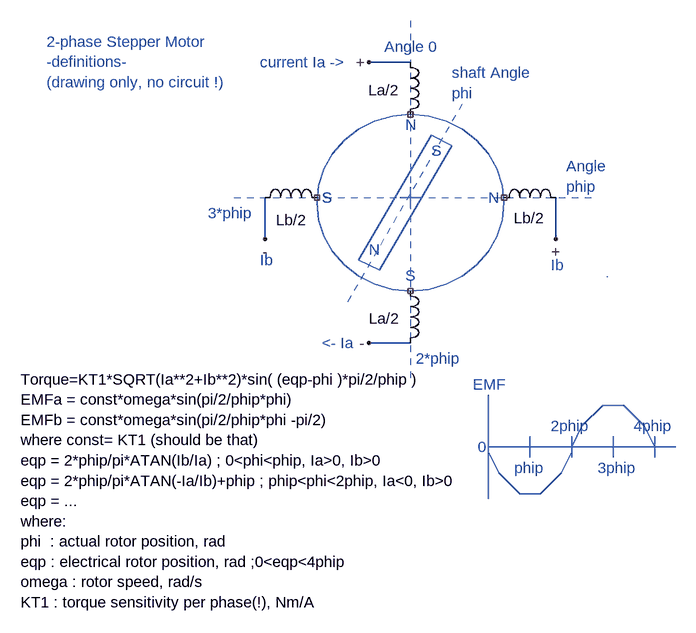
[diagram p0: schematic _stepper_definitions.asc]
_stepper_definitions.asc, the LTspice schematic file:
Version 4
SHEET 1 880 816
WIRE -160 272 -160 208
WIRE 64 0 0 0
WIRE 64 432 0 432
WIRE 288 272 288 208
FLAG 0 0 +
FLAG 288 272 +
FLAG 0 432 -
FLAG -160 272 -
SYMBOL ind 48 -16 R0
WINDOW 0 36 40 Invisible 0
WINDOW 3 -49 59 Left 0
SYMATTR InstName L1
SYMATTR Value La/2
SYMBOL ind 48 336 R0
WINDOW 0 36 40 Invisible 0
WINDOW 3 -48 58 Left 0
SYMATTR InstName L2
SYMATTR Value La/2
SYMBOL ind 192 224 R270
WINDOW 0 32 56 Invisible 0
WINDOW 3 -16 31 VRight 0
SYMATTR InstName L3
SYMATTR Value Lb/2
SYMBOL ind -176 224 R270
WINDOW 0 32 56 Invisible 0
WINDOW 3 -19 33 VRight 0
SYMATTR InstName L4
SYMATTR Value Lb/2
TEXT 128 16 Left 0 ;shaft Angle\nphi
TEXT 304 160 Left 0 ;Angle\nphip
TEXT 24 -24 Left 0 ;Angle 0
TEXT 96 136 Left 0 ;S
TEXT 0 288 Left 0 ;N
TEXT 56 96 Left 0 ;N
TEXT 184 208 Left 0 ;N
TEXT -72 208 Left 0 ;S
TEXT -72 208 Left 0 ;S
TEXT 56 328 Left 0 ;S
TEXT -496 -32 Left 0 ;2-phase Stepper Motor\n-definitions-\n(drawing only, no circuit !)
TEXT 72 456 Left 0 ;2*phip
TEXT -248 232 Left 0 ;3*phip
TEXT -168 0 Left 0 ;current Ia ->
TEXT 280 312 Left 0 ;Ib
TEXT -72 432 Left 0 ;<- Ia
TEXT -168 304 Left 0 ;Ib
TEXT 160 496 Left 0 ;EMF
TEXT 224 624 Left 0 ;phip
TEXT 280 560 Left 0 ;2phip
TEXT 352 624 Left 0 ;3phip
TEXT 408 560 Left 0 ;4phip
TEXT 168 592 Left 0 ;0
TEXT -536 488 Left 0 !Torque=KT1*SQRT(Ia**2+Ib**2)*sin( (eqp-phi )*pi/2/phip )\nEMFa = const*omega*sin(pi/2/phip*phi)\nEMFb = const*omega*sin(pi/2/phip*phi -pi/2)\nwhere const= KT1 (should be that)\neqp = 2*phip/pi*ATAN(Ib/Ia) ; 0<phi<phip, Ia>0, Ib>0\neqp = 2*phip/pi*ATAN(-Ia/Ib)+phip ; phip<phi<2phip, Ia<0, Ib>0\neqp = ...\nwhere:\nphi  : actual rotor position, rad\neqp : electrical rotor position, rad ;0<eqp<4phip\nomega : rotor speed, rad/s\nKT1 : torque sensitivity per phase(!), Nm/A
LINE Normal 80 208 48 208
LINE Normal 64 224 64 192
LINE Normal -16 304 96 112
LINE Normal 16 320 128 128
LINE Normal 128 128 96 112
LINE Normal 16 320 -16 304
LINE Normal -32 368 144 64 2
LINE Normal -208 208 352 208 2
LINE Normal 64 -64 64 496 2
LINE Normal -208 208 352 208 2
LINE Normal 328 560 312 592
LINE Normal 360 528 328 560
LINE Normal 376 528 360 528
LINE Normal 392 528 376 528
LINE Normal 424 560 392 528
LINE Normal 440 592 424 560
LINE Normal 184 600 184 600
LINE Normal 312 608 312 576
LINE Normal 184 672 184 512
LINE Normal 440 608 440 576
LINE Normal 296 632 312 600
LINE Normal 264 664 296 632
LINE Normal 248 664 264 664
LINE Normal 232 664 248 664
LINE Normal 200 632 232 664
LINE Normal 184 600 200 632
LINE Normal 184 600 184 600
LINE Normal 376 608 376 576
LINE Normal 248 608 248 576
LINE Normal 472 592 184 592
LINE Normal 472 592 472 592
CIRCLE Normal 208 352 -80 80
ARC Normal 128 16 448 352 365 327 376 344 2

The netlist it stands for:
* _stepper_definitions.asc
L1 + NC_01 La/2
L2 NC_02 - La/2
L3 NC_03 + Lb/2
L4 - NC_04 Lb/2
* shaft Angle
* phi
* Angle
* phip
* Angle 0
* S
* N
* N
* N
* S
* S
* S
* 2-phase Stepper Motor
* -definitions-
* (drawing only, no circuit !)
* 2*phip
* 3*phip
* current Ia ->
* Ib
* <- Ia
* Ib
* EMF
* phip
* 2phip
* 3phip
* 4phip
* 0
Torque=KT1*SQRT(Ia**2+Ib**2)*sin( (eqp-phi )*pi/2/phip )
EMFa = const*omega*sin(pi/2/phip*phi)
EMFb = const*omega*sin(pi/2/phip*phi -pi/2)
where const= KT1 (should be that)
eqp = 2*phip/pi*ATAN(Ib/Ia) ; 0<phi<phip, Ia>0, Ib>0
eqp = 2*phip/pi*ATAN(-Ia/Ib)+phip ; phip<phi<2phip, Ia<0, Ib>0
eqp = ...
where:
phi  : actual rotor position, rad
eqp : electrical rotor position, rad ;0<eqp<4phip
omega : rotor speed, rad/s
KT1 : torque sensitivity per phase(!), Nm/A
.backanno
.end